# Altium schematic sheet shutter.SchDoc: Shutter interface board
size A3; Author: Francesco Sacchi <batt@develer.com>; Organization: Develer s.r.l.; Address1: via Mugellese 1/A; Address2: 50019 Campi Bisenzio; Address3: Firenze; Address4: ITALY; DocumentNumber: 1; Revision: 0; SheetNumber: 1; SheetTotal: 6
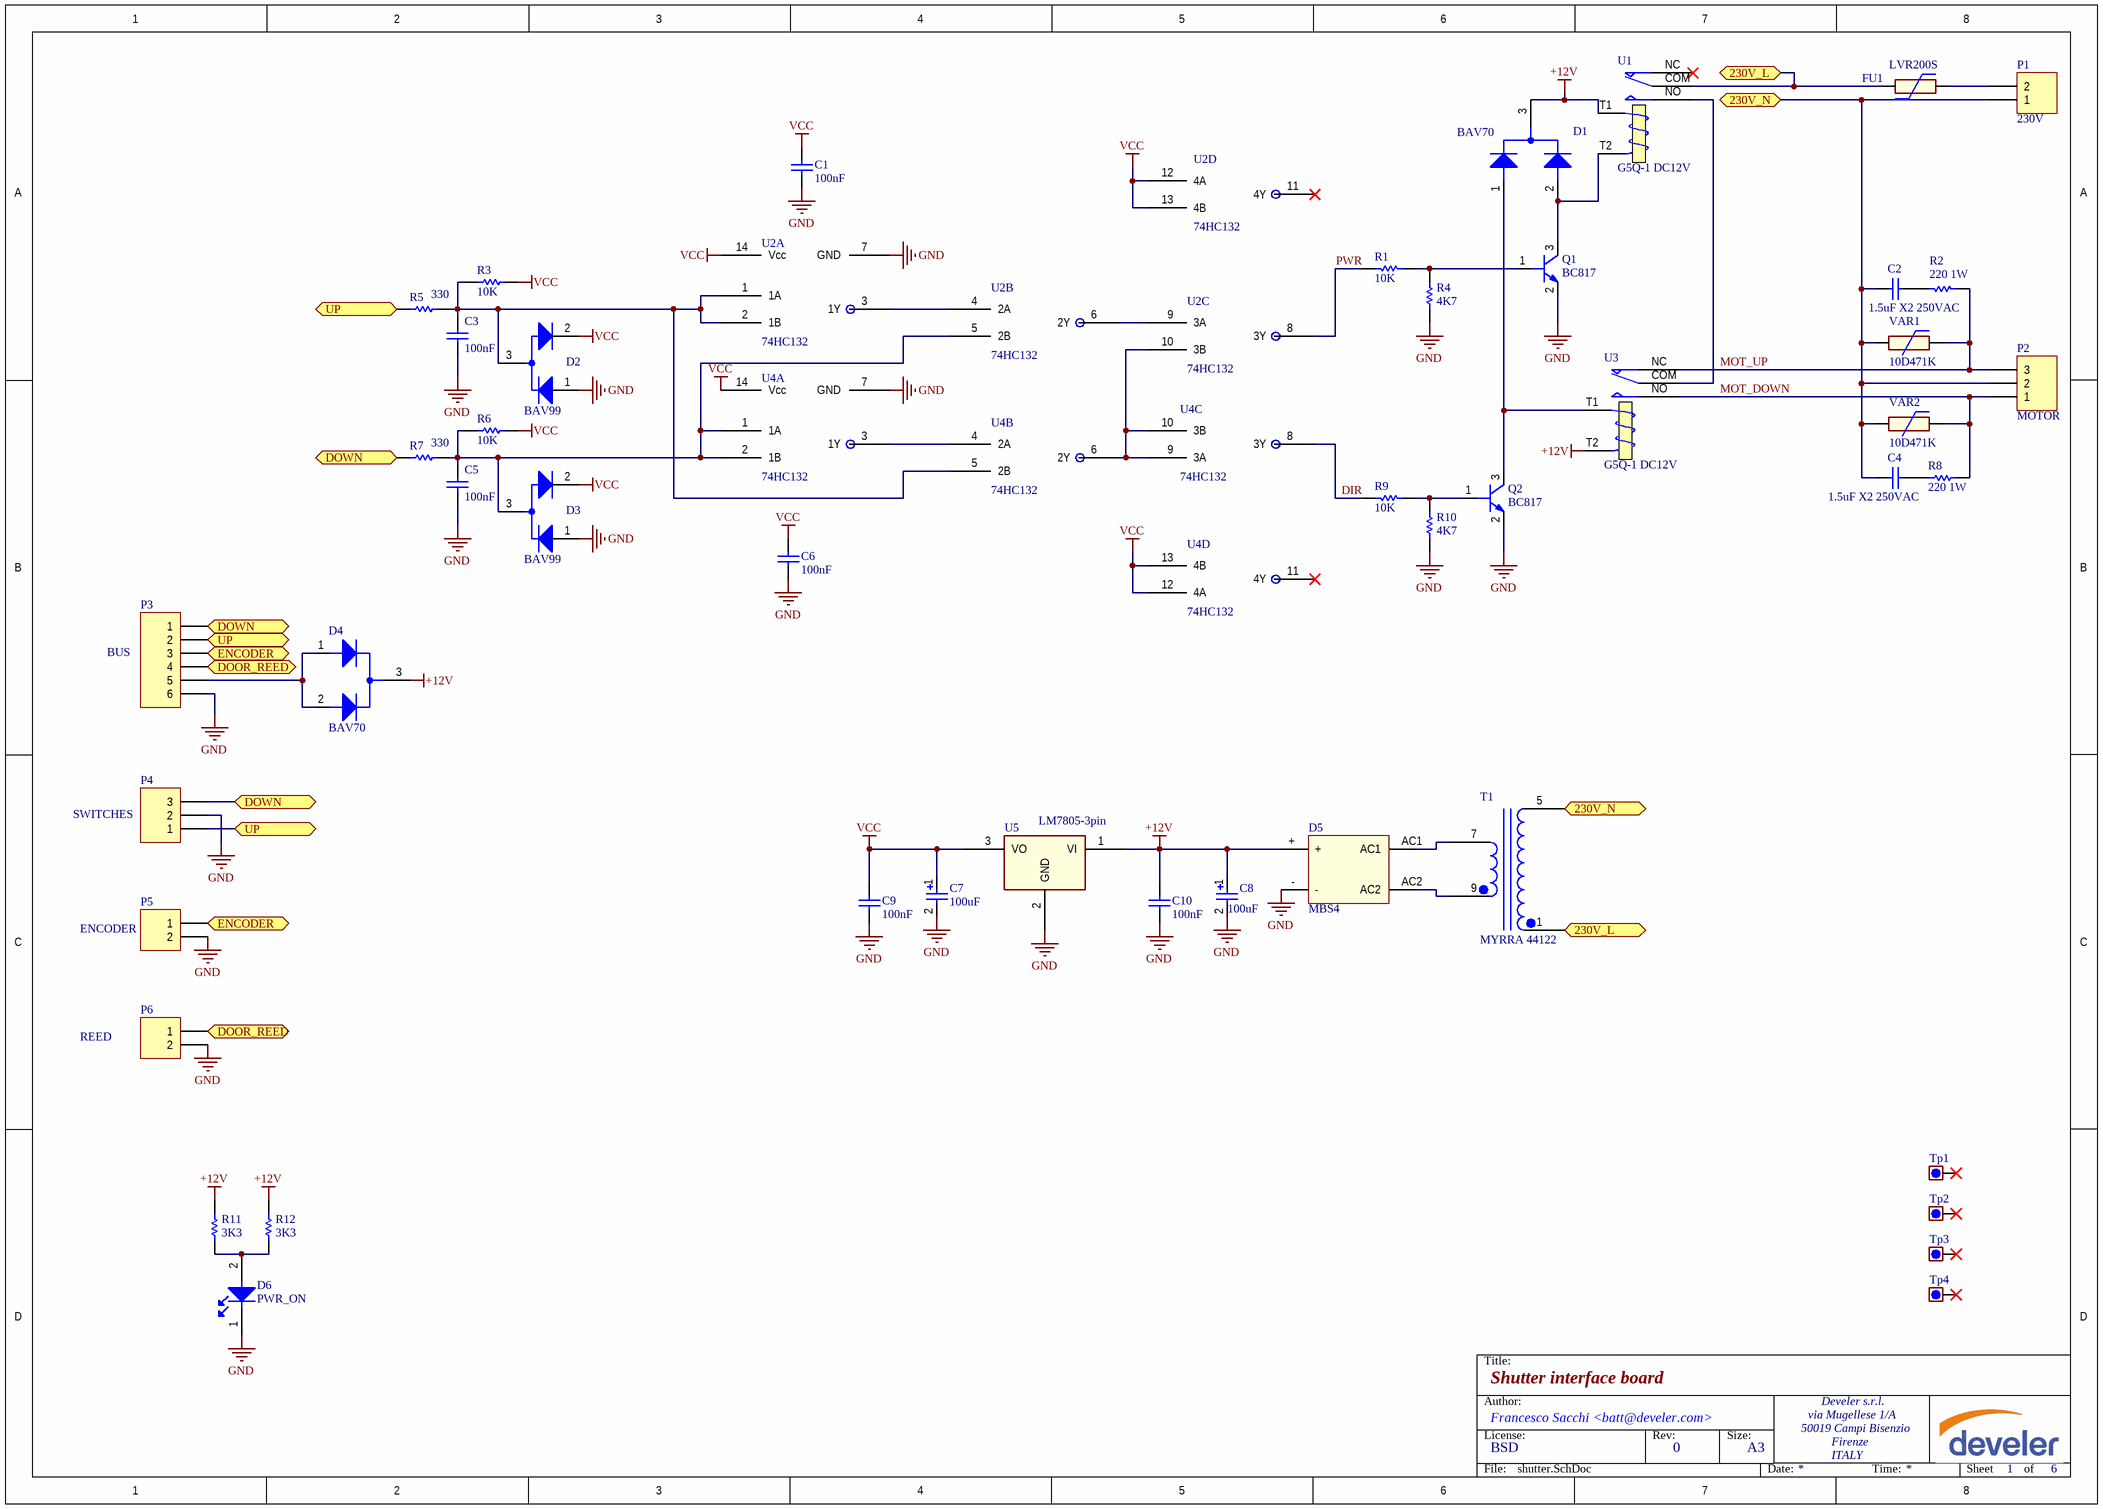
[diagram p0: shutter.SchDoc]

## Parts
C1  100nF  [0603_[1608]]
C2  1.5uF X2 250VAC  [RADIAL-22MM]
C3  100nF  [0603_[1608]]
C4  1.5uF X2 250VAC  [RADIAL-22MM]
C5  100nF  [0603_[1608]]
C6  100nF  [0603_[1608]]
C7  100uF  [[7343]_CAP_TAN]
C8  100uF  [[7343]_CAP_TAN]
C9  100nF  [0603_[1608]]
C10  100nF  [0603_[1608]]
D1  BAV70  [SOT-23_L]
D2  BAV99  [SOT-23]
D3  BAV99  [SOT-23]
D4  BAV70  [SOT-23_L]
D5  MBS4  [Diode_bridge_smd]
D6  PWR_ON  [0805_[2012]_LED]
FU1  LVR200S  [RADIAL-10mm-25x6mm]
P1  230V  [TBLOCK_1X2_5.08MM_THD]
P2  MOTOR  [TBLOCK_1X3_5.08MM_THD]
P3  BUS  [TBLOCK_1X6_3.5MM_HOR_THD]
P4  SWITCHES  [TBLOCK_1X3_5.08MM_THD]
P5  ENCODER  [TBLOCK_1X2_3.5MM_HOR_THD]
P6  REED  [TBLOCK_1X2_3.5MM_HOR_THD]
Q1  BC817  [SOT-23]
Q2  BC817  [SOT-23]
R1  10K  [0603_[1608]]
R2  220 1W  [AXIAL 15mm]
R3  10K  [0603_[1608]]
R4  4K7  [0603_[1608]]
R5  330  [0603_[1608]]
R6  10K  [0603_[1608]]
R7  330  [0603_[1608]]
R8  220 1W  [AXIAL 15mm]
R9  10K  [0603_[1608]]
R10  4K7  [0603_[1608]]
R11  3K3  [0603_[1608]]
R12  3K3  [0603_[1608]]
T1  MYRRA 44122  [Transformer_26.7x31.7]
Tp1  (no value)  [Hole_M3x6mm]  (no BOM)
Tp2  (no value)  [Hole_M3x6mm]  (no BOM)
Tp3  (no value)  [Hole_M3x6mm]  (no BOM)
Tp4  (no value)  [Hole_M3x6mm]  (no BOM)
U1  G5Q-1 DC12V  [RELAYS_SPCO_THD_20x10mirror]
U2  74HC132  [SOIC14]  (parts A,B,C,D of 4)
U3  G5Q-1 DC12V  [RELAYS_SPCO_THD_20x10mirror]
U4  74HC132  [SOIC14]  (parts A,B,C,D of 4)
U5  LM7805-3pin  [TO-220_VERTICAL]
VAR1  10D471K  [CAP_DISK_7.5MM_THD]
VAR2  10D471K  [CAP_DISK_7.5MM_THD]

## Ports
230V_L, 230V_N, DOOR_REED, DOWN, ENCODER, UP

## Nets
+12V: C8.1 C10.2 D1.3 D4.3 D5.+ R11.2 R12.2 U1.T1 U3.T2 U5.1(VI)
GND: C1.1 C3.1 C5.1 C6.1 C7.2 C8.2 C9.1 C10.1 D2.1 D3.1 D5.- D6.1(K) P3.6 P4.2 P5.2 P6.2 Q1.2(E) Q2.2(E) R4.1 R10.1 U2.7(GND) U4.7(GND) U5.2(GND)
VCC: C1.2 C6.2 C7.1 C9.2 D2.2 D3.2 R3.2 R6.2 U2.12(4A) U2.13(4B) U2.14(Vcc) U4.12(4A) U4.13(4B) U4.14(Vcc) U5.3(VO)
230V_L: FU1.1 T1.1 U1.COM ; port 230V_L
230V_N: C2.1 C4.1 P1.1 P2.2 T1.5 VAR1.1 VAR2.1 ; port 230V_N
DIR: R9.1 U4.8(3Y)
DOOR_REED: P3.4 P6.1 ; port DOOR_REED
DOWN: P3.1 P4.3 R7.2 ; port DOWN
ENCODER: P3.3 P5.1 ; port ENCODER
MOT_DOWN: P2.1 R8.2 U3.NO VAR2.2
MOT_UP: P2.3 R2.2 U3.NC VAR1.2
PWR: R1.1 U2.8(3Y)
UP: P3.2 P4.1 R5.2 ; port UP
NetC2_2: C2.2 R2.1
NetC3_2: C3.2 D2.3 R3.1 R5.1 U2.1(1A) U2.2(1B) U4.5(2B)
NetC4_2: C4.2 R8.1
NetC5_2: C5.2 D3.3 R6.1 R7.1 U2.5(2B) U4.1(1A) U4.2(1B)
NetD1_1: D1.1 Q2.3(C) U3.T1
NetD1_2: D1.2 Q1.3(C) U1.T2
NetD4_1: D4.1 D4.2 P3.5
NetD5_AC1: D5.AC1 T1.7
NetD5_AC2: D5.AC2 T1.9
NetD6_2: D6.2(A) R11.1 R12.1
NetFU1_2: FU1.2 P1.2
NetQ1_1: Q1.1(B) R1.2 R4.2
NetQ2_1: Q2.1(B) R9.2 R10.2
NetU1_NO: U1.NO U3.COM
NetU2_3: U2.3(1Y) U2.4(2A)
NetU2_6: U2.6(2Y) U2.9(3A)
NetU2_10: U2.10(3B) U4.6(2Y) U4.9(3A) U4.10(3B)
NetU4_3: U4.3(1Y) U4.4(2A)

Not connected (* = marked no-connect by the designer): Tp1 1*; Tp2 1*; Tp3 1*; Tp4 1*; U1 NC*; U2 11(4Y)*; U4 11(4Y)*

## Notes on the sheet
- Title:
- Author:
- License:
- BSD
- Rev:
- Size:
- A3
- File:
- Date:
- Time:
- Sheet
- of

## Library data of the parts
C1 C2 C4 C6 C9 C10 = Cap: Ceramic X7R 50V; Value: 100pF; Published: 8-Jun-2000; LatestRevisionDate: 17-Jul-2002; LatestRevisionNote: Re-released for DXP Platform.; PackageReference: RAD-0.3; Publisher: Altium Limited; PackageDescription: Radial Cap, Thru-Hole; 2 Leads; 0.3 in Pin Spacing
C3 C5 = Cap: Ceramic X5R 6.3V, 10V; Value: 10nF; Published: 8-Jun-2000; Revision: July-2002: Re-released for DXP Platform.; Publisher: Altium Limited
C7 C8 = Cap Pol1: Tantalum 25V T491X107K025AT; Value: 10uF; Published: 8-Jun-2000; Revision: July-2002: Re-released for DXP Platform.; Publisher: Altium Limited
D1 D4 = BAV70: SOT23
D2 D3 = BAV99: SOT23
D5 = Diode_bridge2
D6 = LED: Multicolor LED
FU1 = FuseAutoReset: Fuse autoreset
P1 P5 P6 = Header 2: Header, 2-Pin; LatestRevisionDate: 17-Jul-2002; LatestRevisionNote: Re-released for DXP Platform.; Publisher: Altium Limited
P2 P4 = Header 3: Header, 3-Pin; LatestRevisionDate: 17-Jul-2002; LatestRevisionNote: Re-released for DXP Platform.; Publisher: Altium Limited
P3 = Header 6: Header, 6-Pin; LatestRevisionDate: 17-Jul-2002; LatestRevisionNote: Re-released for DXP Platform.; Publisher: Altium Limited
Q1 Q2 = BC817: NPN Transistor
R1 R2 R4 R8-R12 = Res1: Resistor; Revision: July-2002: Re-released for DXP Platform.
R3 R5-R7 = Res1: Resistor; Value: 1K; Published: 8-Jun-2000; Revision: July-2002: Re-released for DXP Platform.; Publisher: Altium Limited
T1 = transformer_myrra_44087
Tp1-Tp4 = Test_point
U1 U3 = Relay SPCO
U2 U4 = 74HC00: 4 NAND ports
VAR1 VAR2 = VARISTOR
U5 = LM7805-3pin: case: THD